# Altium schematic sheet TempSensorDisplay.SchDoc
size A4
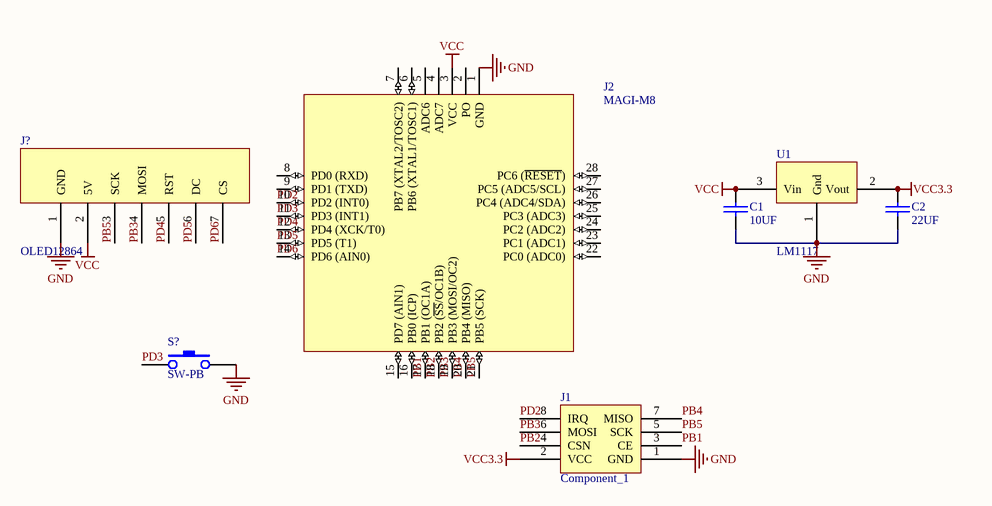
[diagram p0: TempSensorDisplay.SchDoc]

## Parts
C1  10UF  [0805]
C2  22UF  [0805]
J1  Component_1  [NRF24L01]
J2  MAGI-M8  [MAGI-M8]
J?  OLED12864  [SIP7]
S?  SW-PB  [SW-PB]
U1  LM1117  [SOT-223]

## Nets
GND: C1.2 C2.2 J1.1(GND) J2.1(GND) J?.1(GND) S?.2 U1.1(Gnd)
VCC: C1.1 J2.3(VCC) J?.2(5V) U1.3(Vin)
VCC3.3: C2.1 J1.2(VCC) U1.2(Vout)
PB1: J1.3(CE) J2.17(PB1_(OC1A))
PB2: J1.4(CSN) J2.18(PB2_(~{SS}/OC1B))
PB3: J1.6(MOSI) J2.19(PB3_(MOSI/OC2)) J?.4(MOSI)
PB4: J1.7(MISO) J2.20(PB4_(MISO))
PB5: J1.5(SCK) J2.21(PB5_(SCK)) J?.3(SCK)
PD2: J1.8(IRQ) J2.10(PD2_(INT0))
PD3: J2.11(PD3_(INT1)) S?.1
PD4: J2.12(PD4_(XCK/T0)) J?.5(RST)
PD5: J2.13(PD5_(T1)) J?.6(DC)
PD6: J2.14(PD6_(AIN0)) J?.7(CS)

Not connected (* = marked no-connect by the designer): J2 2(PO) 4(ADC7) 5(ADC6) 6(PB6_(XTAL1/TOSC1)) 7(PB7_(XTAL2/TOSC2)) 8(PD0_(RXD)) 9(PD1_(TXD)) 15(PD7_(AIN1)) 16(PB0_(ICP)) 22(PC0_(ADC0)) 23(PC1_(ADC1)) 24(PC2_(ADC2)) 25(PC3_(ADC3)) 26(PC4_(ADC4/SDA)) 27(PC5_(ADC5/SCL)) 28(PC6_(~{RESET}))

## Library data of the parts
C1 C2 = CAP_1: Capacitor